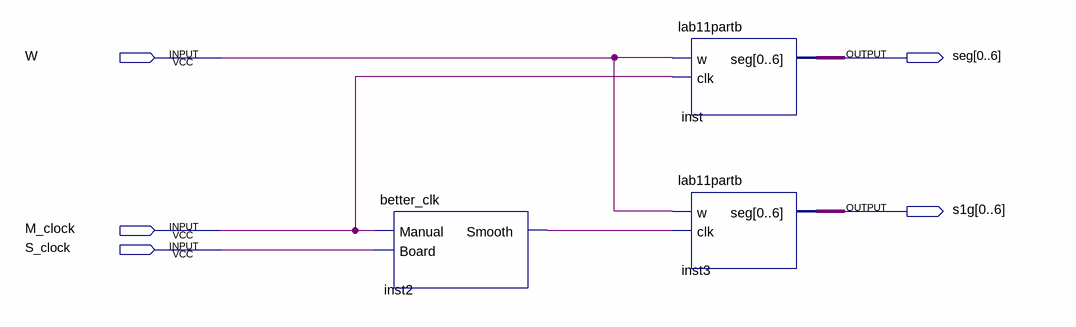
[diagram p0: schematic sheet]
// Quartus schematic Block4.bdf as structural Verilog: 3 symbols, 5 pins
module Block4 (
  input  W,
  input  M_clock,
  input  S_clock,
  output [0:6] seg,
  output [0:6] s1g
);

  wire inst2_smooth;

  better_clk inst2 (.Manual(M_clock), .Board(S_clock), .Smooth(inst2_smooth));
  lab11partb inst (.w(W), .clk(M_clock), .seg(seg));
  lab11partb inst3 (.w(W), .clk(inst2_smooth), .seg(s1g));
endmodule
